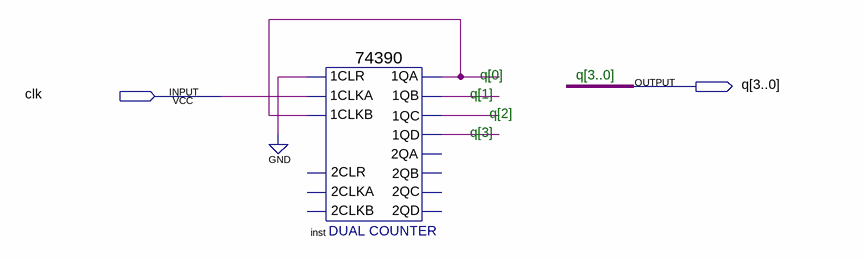
[diagram p0: schematic sheet]
// Quartus schematic cnt10.bdf as structural Verilog: 1 symbols, 2 pins
module cnt10 (
  input  clk,
  output [3:0] q
);

  wire inst_1qa, inst_1qb, inst_1qc, inst_1qd;

  \74390  inst (
    .\1CLR (1'b0), .\1CLKA (clk), .\1CLKB (inst_1qa), .\1QA (inst_1qa), .\1QB (inst_1qb), .\1QC (inst_1qc),
    .\1QD (inst_1qd));  // open: 2CLKA, 2CLR, 2CLKB, 2QA, 2QB, 2QC, 2QD

  // Notes on the sheet:
  //   q[0]
  //   q[3..0]
  //   q[1]
  //   q[2]
  //   q[3]
endmodule
